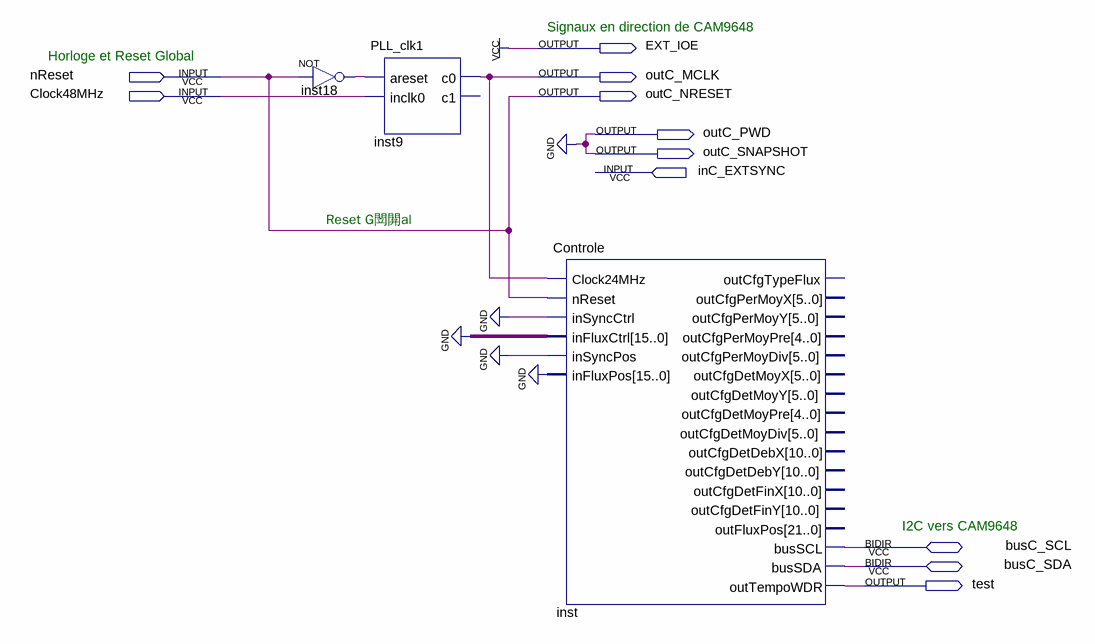
[diagram p0: schematic sheet]
// Quartus schematic Minimal_KAC9648.bdf as structural Verilog: 3 symbols, 11 pins
module Minimal_KAC9648 (
  input  nReset,
  input  Clock48MHz,
  input  inC_EXTSYNC,
  inout  busC_SCL,
  inout  busC_SDA,
  output EXT_IOE,
  output outC_MCLK,
  output outC_NRESET,
  output outC_PWD,
  output outC_SNAPSHOT,
  output test
);

  wire inst18_out;

  not inst18 (inst18_out, nReset);
  PLL_clk1 inst9 (.areset(inst18_out), .inclk0(Clock48MHz), .c0(outC_MCLK));  // open: c1
  Controle inst (
    .Clock24MHz(outC_MCLK), .nReset(nReset), .inSyncCtrl(1'b0), .inFluxCtrl({16{1'b0}}), .inSyncPos(1'b0),
    .inFluxPos({16{1'b0}}), .outTempoWDR(test), .busSCL(busC_SCL), .busSDA(busC_SDA));  // open: outCfgTypeFlux, outCfgPerMoyX, outCfgPerMoyY, outCfgPerMoyPre, outCfgPerMoyDiv, outCfgDetMoyX, outCfgDetMoyY, outCfgDetMoyPre, outCfgDetMoyDiv, outCfgDetDebX, outCfgDetDebY, outCfgDetFinX, outCfgDetFinY, outFluxPos

  assign EXT_IOE = 1'b1;
  assign outC_NRESET = nReset;
  assign outC_PWD = 1'b0;
  assign outC_SNAPSHOT = 1'b0;

  // Notes on the sheet:
  //   Signaux en direction de CAM9648
  //   Horloge et Reset Global
  //   Reset G閚閞al
  //   I2C vers CAM9648
endmodule
